# Altium schematic sheet amp_ganho_ajustavel.SchDoc
size A4
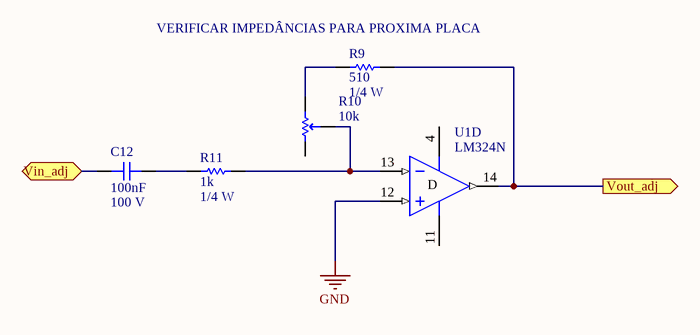
[diagram p0: amp_ganho_ajustavel.SchDoc]

## Parts
C12  100nF  Voltage: 100 V  [0805C]
R9  510  Power: 1/4 W  [0805R]
R10  10k  [Trimpot-3296W]
R11  1k  Power: 1/4 W  [0805R]
U1  LM324N  [N014]  (part D of 4)

## Ports
Vin_adj, Vout_adj (out)

## Nets
GND: U1.12(IN+)
Vin_adj: C12.1 ; port Vin_adj
Vout_adj: R9.2 U1.14(OUT) ; port Vout_adj
NetC12_2: C12.2 R11.1
NetR9_1: R9.1 R10.1
NetR10_3: R10.3 R11.2 U1.13(IN-)

Not connected (* = marked no-connect by the designer): R10 2; U1 4(V+) 11(V-)

## Notes on the sheet
- (near R9) VERIFICAR IMPEDÂNCIAS PARA PROXIMA PLACA
- (in symbol LM324N, part D) D

## Library data of the parts
C12 = Capacitor: Published: 8-Jun-2000; LatestRevisionDate: 17-Jul-2002; LatestRevisionNote: Re-released for DXP Platform.; PackageReference: RAD-0.3; Publisher: Altium Limited
R9 R11 = Resistor: Tolerance: 5%; Published: 8-Jun-2000; LatestRevisionDate: 17-Jul-2002; LatestRevisionNote: Re-released for DXP Platform.; PackageReference: AXIAL-0.3; Publisher: Altium Limited
R10 = Trimpot
U1 = LM324N: Quadruple Operational Amplifier; Published: 16-Jan-2001; LatestRevisionDate: 04-Mar-2005; LatestRevisionNote: Stylized 3D Model Added.; DatasheetVersion: Feb-1997; PackageVersion: Oct-1995; PackageReference: N014; Publisher: Altium Limited; PackageDescription: DIP; 14 Leads; Row Spacing 7.62 mm; Pitch 2.54 mm; ComponentLink1Description: Manufacturer Link; ComponentLink1URL: http://www.ti.com/; ComponentLink2Description: Datasheet; ComponentLink2URL: http://www-s.ti.com/sc/ds/lm324.pdf